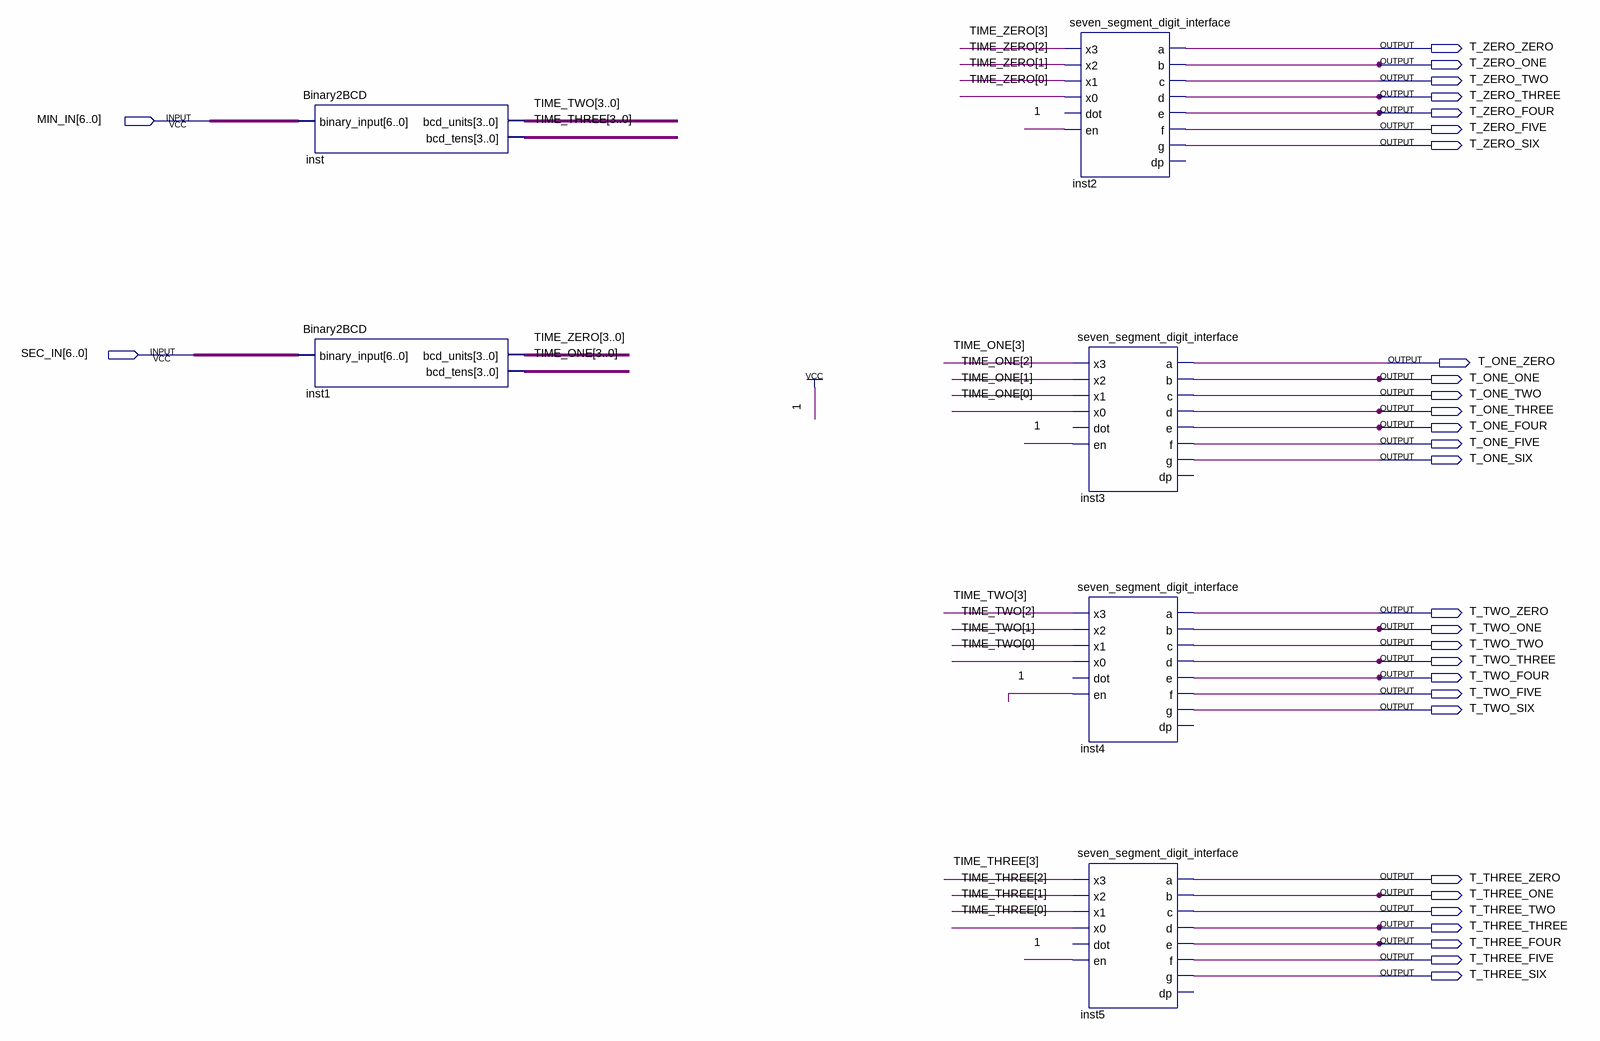
[diagram p0: schematic sheet]
// Quartus schematic SevenSegDriver.bdf as structural Verilog: 6 symbols, 30 pins
module SevenSegDriver (
  input  [6:0] MIN_IN,
  input  [6:0] SEC_IN,
  output T_ZERO_ZERO,
  output T_ZERO_ONE,
  output T_ZERO_TWO,
  output T_ZERO_THREE,
  output T_ZERO_FOUR,
  output T_ZERO_FIVE,
  output T_ZERO_SIX,
  output T_ONE_ZERO,
  output T_ONE_ONE,
  output T_ONE_TWO,
  output T_ONE_THREE,
  output T_ONE_FOUR,
  output T_ONE_FIVE,
  output T_ONE_SIX,
  output T_TWO_ZERO,
  output T_TWO_ONE,
  output T_TWO_TWO,
  output T_TWO_THREE,
  output T_TWO_FOUR,
  output T_TWO_FIVE,
  output T_TWO_SIX,
  output T_THREE_ZERO,
  output T_THREE_ONE,
  output T_THREE_TWO,
  output T_THREE_THREE,
  output T_THREE_FOUR,
  output T_THREE_FIVE,
  output T_THREE_SIX
);

  wire [3:0] TIME_ONE, TIME_THREE, TIME_TWO, TIME_ZERO;

  Binary2BCD inst (.binary_input(MIN_IN), .bcd_units(TIME_TWO), .bcd_tens(TIME_THREE));
  Binary2BCD inst1 (.binary_input(SEC_IN), .bcd_units(TIME_ZERO), .bcd_tens(TIME_ONE));
  seven_segment_digit_interface inst2 (
    .x3(TIME_ZERO[3]), .x2(TIME_ZERO[2]), .x1(TIME_ZERO[1]), .x0(TIME_ZERO[0]), .en(1'b1), .a(T_ZERO_ZERO),
    .b(T_ZERO_ONE), .c(T_ZERO_TWO), .d(T_ZERO_THREE), .e(T_ZERO_FOUR), .f(T_ZERO_FIVE), .g(T_ZERO_SIX));  // open: dot, dp
  seven_segment_digit_interface inst3 (
    .x3(TIME_ONE[3]), .x2(TIME_ONE[2]), .x1(TIME_ONE[1]), .x0(TIME_ONE[0]), .en(1'b1), .a(T_ONE_ZERO),
    .b(T_ONE_ONE), .c(T_ONE_TWO), .d(T_ONE_THREE), .e(T_ONE_FOUR), .f(T_ONE_FIVE), .g(T_ONE_SIX));  // open: dot, dp
  seven_segment_digit_interface inst4 (
    .x3(TIME_TWO[3]), .x2(TIME_TWO[2]), .x1(TIME_TWO[1]), .x0(TIME_TWO[0]), .en(1'b1), .a(T_TWO_ZERO),
    .b(T_TWO_ONE), .c(T_TWO_TWO), .d(T_TWO_THREE), .e(T_TWO_FOUR), .f(T_TWO_FIVE), .g(T_TWO_SIX));  // open: dot, dp
  seven_segment_digit_interface inst5 (
    .x3(TIME_THREE[3]), .x2(TIME_THREE[2]), .x1(TIME_THREE[1]), .x0(TIME_THREE[0]), .en(1'b1),
    .a(T_THREE_ZERO), .b(T_THREE_ONE), .c(T_THREE_TWO), .d(T_THREE_THREE), .e(T_THREE_FOUR),
    .f(T_THREE_FIVE), .g(T_THREE_SIX));  // open: dot, dp
endmodule
